# EAGLE design LEDRing (EAGLE 7.3.0)
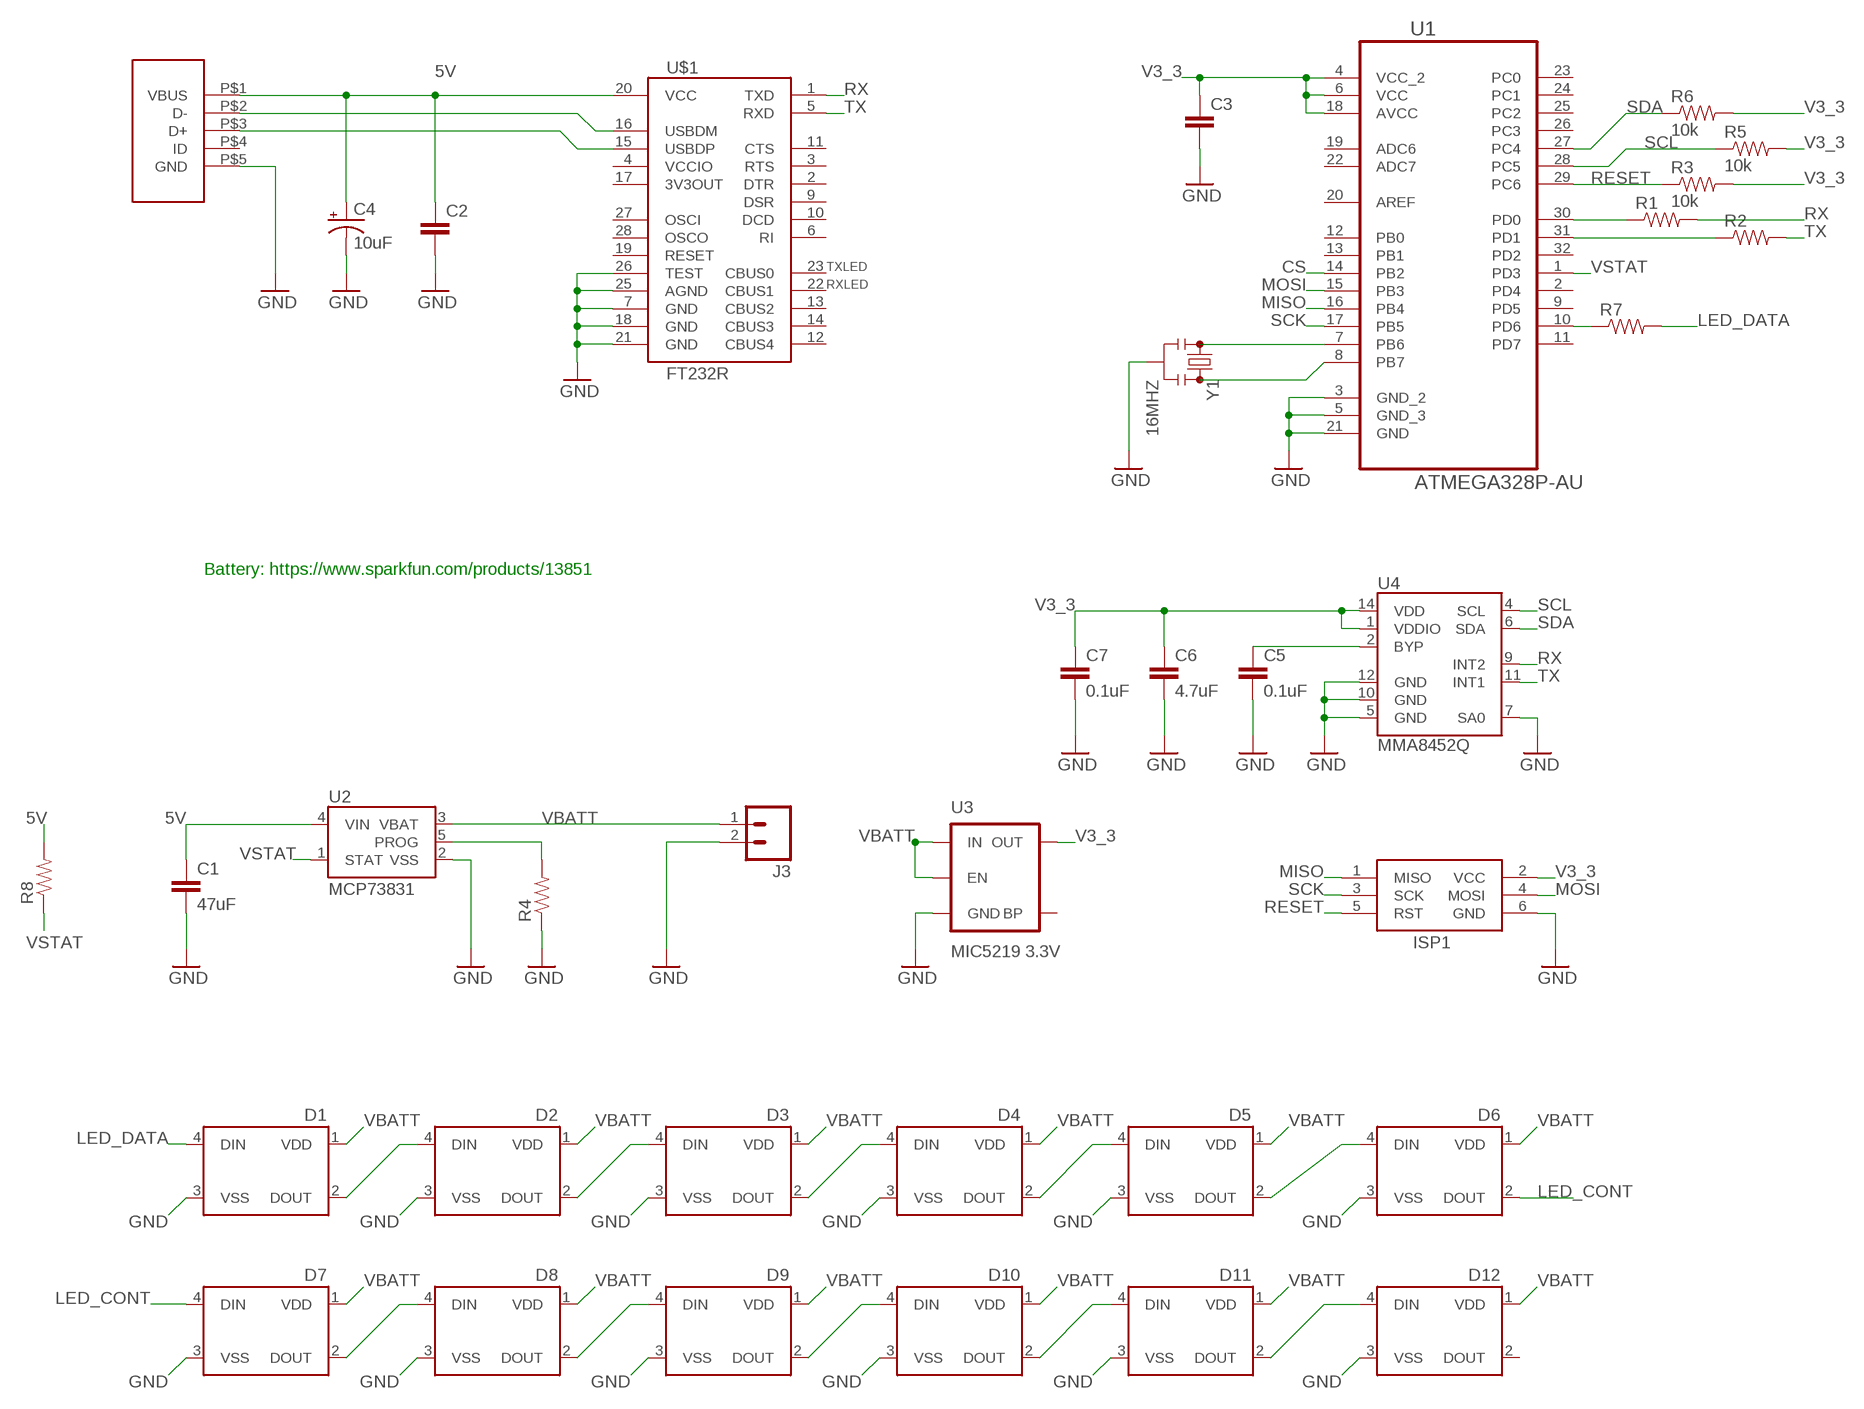
[diagram p0: schematic, sheet 1]

## Parts
C1  47uF  CAP0603-CAP  [0603-CAP]
C2  CAP0603-CAP  [0603-CAP]
C3  CAP0603-CAP  [0603-CAP]
C4  10uF  10UF-6.3V-20%(0603)(TANT)"  [0603-POL]
C5  0.1uF  CAP0603-CAP  [0603-CAP]
C6  4.7uF  CAP0603-CAP  [0603-CAP]
C7  0.1uF  CAP0603-CAP  [0603-CAP]
D1  WS2812B  [WS2812B]
D2  WS2812B  [WS2812B]
D3  WS2812B  [WS2812B]
D4  WS2812B  [WS2812B]
D5  WS2812B  [WS2812B]
D6  WS2812B  [WS2812B]
D7  WS2812B  [WS2812B]
D8  WS2812B  [WS2812B]
D9  WS2812B  [WS2812B]
D10  WS2812B  [WS2812B]
D11  WS2812B  [WS2812B]
D12  WS2812B  [WS2812B]
ISP1  AVRISP-BOX  [AVRISP-BOX]
J3  M02PTH  [1X02]
R1  RESISTOR0603-RES  [0603-RES]
R2  RESISTOR0603-RES  [0603-RES]
R3  10k  RESISTOR0603-RES  [0603-RES]
R4  RESISTOR0603-RES  [0603-RES]
R5  10k  RESISTOR0603-RES  [0603-RES]
R6  10k  RESISTOR0603-RES  [0603-RES]
R7  RESISTOR0603-RES  [0603-RES]
R8  RESISTOR0603-RES  [0603-RES]
U1  ATMEGA328P-AU  [QFP80P900X900X120-32N]
U2  MCP73831  [SOT23-5]
U3  MIC5219 3.3V  V_REG_MIC52193.3V  [SOT23-5]
U4  MMA8452Q  [QFN-16_0.5MM]
U$1  FT232R  [SSOP-28]
U$2  TE_USB_A121025CT  [TE_USB_A121025CT]
Y1  16MHZ  RESONATOR16MHZ  [RESONATOR-SMD]

## Nets
5V: C1.1 C2.1 C4.A(+) R8.2 U2.4(VIN) U$1.20(VCC) U$2.P$1(VBUS)
CS: U1.14(PB2)
GND: C1.2 C2.2 C3.2 C4.K(-) C5.2 C6.2 C7.2 D1.3(VSS) D2.3(VSS) D3.3(VSS) D4.3(VSS) D5.3(VSS) D6.3(VSS) D7.3(VSS) D8.3(VSS) D9.3(VSS) D10.3(VSS) D11.3(VSS) D12.3(VSS) ISP1.6(GND) J3.2 R4.1 U1.3(GND_2) U1.5(GND_3) U1.21(GND) U2.2(VSS) U3.2(GND) U4.5(GND) U4.7(SA0) U4.10(GND) U4.12(GND) U$1.7(GND) U$1.18(GND) U$1.21(GND) U$1.25(AGND) U$1.26(TEST) U$2.P$5(GND) Y1.2
LED_CONT: D6.2(DOUT) D7.4(DIN)
LED_DATA: D1.4(DIN) R7.2
MISO: ISP1.1(MISO) U1.16(PB4)
MOSI: ISP1.4(MOSI) U1.15(PB3)
N$1: R1.1 U1.30(PD0)
N$2: R2.1 U1.31(PD1)
N$3: C5.1 U4.2(BYP)
N$4: U$1.16(USBDM) U$2.P$2(D-)
N$5: U$1.15(USBDP) U$2.P$3(D+)
N$7: U1.8(PB7) Y1.3
N$8: U1.7(PB6) Y1.1
N$9: R4.2 U2.5(PROG)
N$10: R7.1 U1.10(PD6)
N$15: D1.2(DOUT) D2.4(DIN)
N$16: D2.2(DOUT) D3.4(DIN)
N$17: D3.2(DOUT) D4.4(DIN)
N$18: D4.2(DOUT) D5.4(DIN)
N$19: D5.2(DOUT) D6.4(DIN)
N$20: D7.2(DOUT) D8.4(DIN)
N$21: D8.2(DOUT) D9.4(DIN)
N$22: D9.2(DOUT) D10.4(DIN)
N$23: D10.2(DOUT) D11.4(DIN)
N$24: D11.2(DOUT) D12.4(DIN)
RESET: ISP1.5(RST) R3.1 U1.29(PC6)
RX: R1.2 U4.9(INT2) U$1.1(TXD)
SCK: ISP1.3(SCK) U1.17(PB5)
SCL: R5.1 U1.28(PC5) U4.4(SCL)
SDA: R6.1 U1.27(PC4) U4.6(SDA)
TX: R2.2 U4.11(INT1) U$1.5(RXD)
V3_3: C3.1 C6.1 C7.1 ISP1.2(VCC) R3.2 R5.2 R6.2 U1.4(VCC_2) U1.6(VCC) U1.18(AVCC) U3.5(OUT) U4.1(VDDIO) U4.14(VDD)
VBATT: D1.1(VDD) D2.1(VDD) D3.1(VDD) D4.1(VDD) D5.1(VDD) D6.1(VDD) D7.1(VDD) D8.1(VDD) D9.1(VDD) D10.1(VDD) D11.1(VDD) D12.1(VDD) J3.1 U2.3(VBAT) U3.1(IN) U3.3(EN)
VSTAT: R8.1 U1.1(PD3) U2.1(STAT)
Unconnected: D12.2(DOUT) U1.2(PD4) U1.9(PD5) U1.11(PD7) U1.12(PB0) U1.13(PB1) U1.19(ADC6) U1.20(AREF) U1.22(ADC7) U1.23(PC0) U1.24(PC1) U1.25(PC2) U1.26(PC3) U1.32(PD2) U3.4(BP) U$1.2(DTR) U$1.3(RTS) U$1.6(RI) U$1.9(DSR) U$1.10(DCD) U$1.11(CTS) U$1.12(CBUS4) U$1.13(CBUS2) U$1.14(CBUS3) U$1.17(3V3OUT) U$1.19(RESET) U$1.22(CBUS1) U$1.23(CBUS0) U$1.27(OSCI) U$1.28(OSCO) U$2.P$4(ID)

## Notes on the sheet
- Battery: https://www.sparkfun.com/products/13851

## Power pins joined to a net without a drawn wire
VCCIO: U$1.4(VCCIO)

## Library data of the parts
C1-C3 C5-C7 = SparkFun-Capacitors:CAP: Capacitor Standard 0603 ceramic capacitor, and 0.1" leaded capacitor.
C4 = SparkFun-Capacitors:10UF-6.3V-20%(0603)(TANT); PROD_ID: CAP-13210
D1-D12 = SparkFun-LED:WS2812B: WS2812B - Intelligent control LED integrated light source Technical Specifications: Power Supply Voltage (VDD): 3.5 to 5.3 V Input Voltage (VI): -0.5 to VDD+0.5 V Operating Junction Temperature (Topt): -25°C to +80°C Storage Temperature Range (Tstg): -55°C to +150°C; PROD_ID: DIO-12503
ISP1 = adafruit:AVRISP: AVR ISP HEADER Standard 6 pin header for AVR programming
J3 = SparkFun-Connectors:M02: Standard 2-pin 0.1" header. Use with - straight break away headers ( PRT-00116) - right angle break away headers (PRT-00553) - swiss pins (PRT-00743) - machine pins (PRT-00117) - female headers (PRT-00115) Molex polarized connector foot print use with: PRT-08233 with associated crimp pins and housings. 2.54_SCREWTERM for use with PRT-10571. 3.5mm Screw Terminal footprints for PRT-08084 5mm Screw Terminal footprints for use with PRT-08432
R1-R8 = SparkFun-Passives:RESISTOR: Resistor Basic schematic elements and footprints for 0603, 1206, and PTH resistors.
U1 = Atmel_By_element14_Batch_1-00:ATMEGA328P-AU: 8-bit Microcontroller with In-System Programmable Flash; MPN: ATMEGA328P-AU; OC_FARNELL: 1715486; OC_NEWARK: 14R4631; PACKAGE: TQFP-32; SUPPLIER: Atmel
U2 = SparkFun-PowerIC:MCP73831: Miniature single cell, fully integrated Li-Ion, Li-polymer charge management controller http://ww1.microchip.com/downloads/en/DeviceDoc/20001984g.pdf IC-09995; PROD_ID: IC-09995
U3 = SparkFun-PowerIC:V_REG_MIC5219: V_REG MIC5219 Standard 3.3V and 5V 500mA LDO voltage regulator in SOT-23 layout. Micrel part MIC5219. BP (by-pass) pin is used to lower output noise with 470pF cap, may be left open.; PROD_ID: VREG-09872
U4 = SparkFun-Sensors:MMA8452Q: MMA8452Q 3-Axis, 12/8-bit Digital Accelerometer Supply Voltage: 1.6-3.6V Range: +/- 2g, 4g, 8g Interface: I2C, 12-bit and 8-bit ODR: 1.56 Hz - 800 Hz Package: QFN-16 http://cache.freescale.com/files/sensors/doc/data_sheet/MMA8452Q.pdf; PROD_ID: IC-10769
U$1 = GeekAmmo:FT232R: FT232R USB UART IC The FT232R is a USB to serial UART interface with advanced features. http://www.ftdichip.com/Support/Documents/DataSheets/ICs/DS_FT232R.pdf
U$2 = LEDRingLib:TE_USB_A121025CT: TE USB Micro USB IP68 Digikey <http://www.digikey.com/en/ptm/t/te-connectivity/te-connectivity-amp/ip68-micro-usb?pn_sku=A121025CT-ND&part_id=5215144&video_source=Part_Detail>
Y1 = SparkFun-FreqCtrl:RESONATOR: Resonator Small SMD resonator. Used, eg, on the Arduino Pro/ Pro Mini boards. 8MHz- XTAL-08895 16MHz- XTAL-08900; PROD_ID: XTAL-08900

## Board
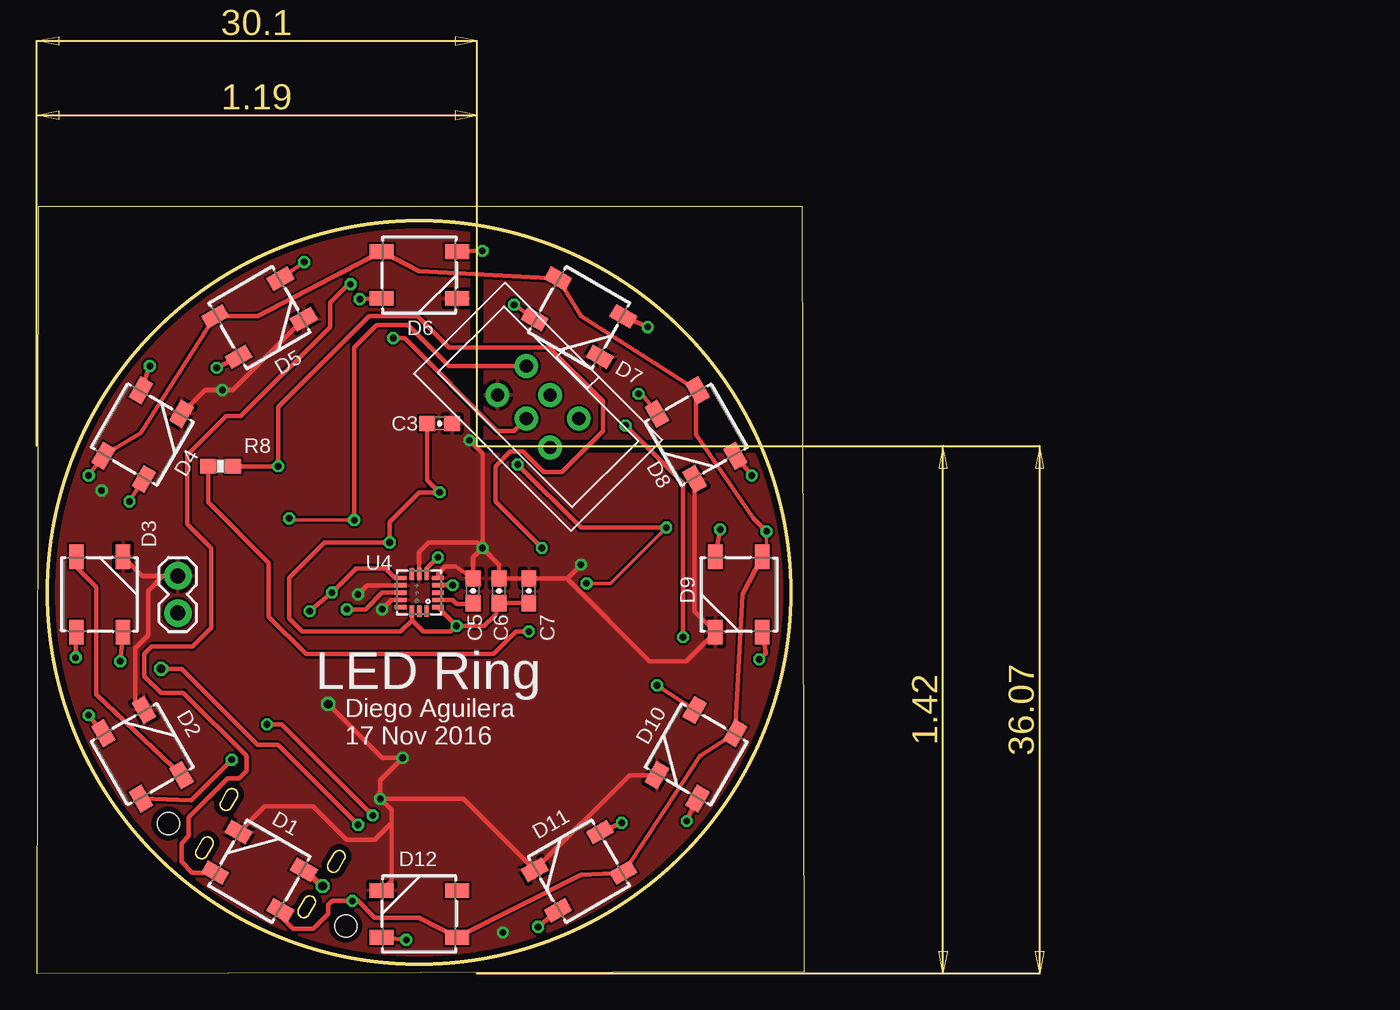
[diagram p1: board, top side]
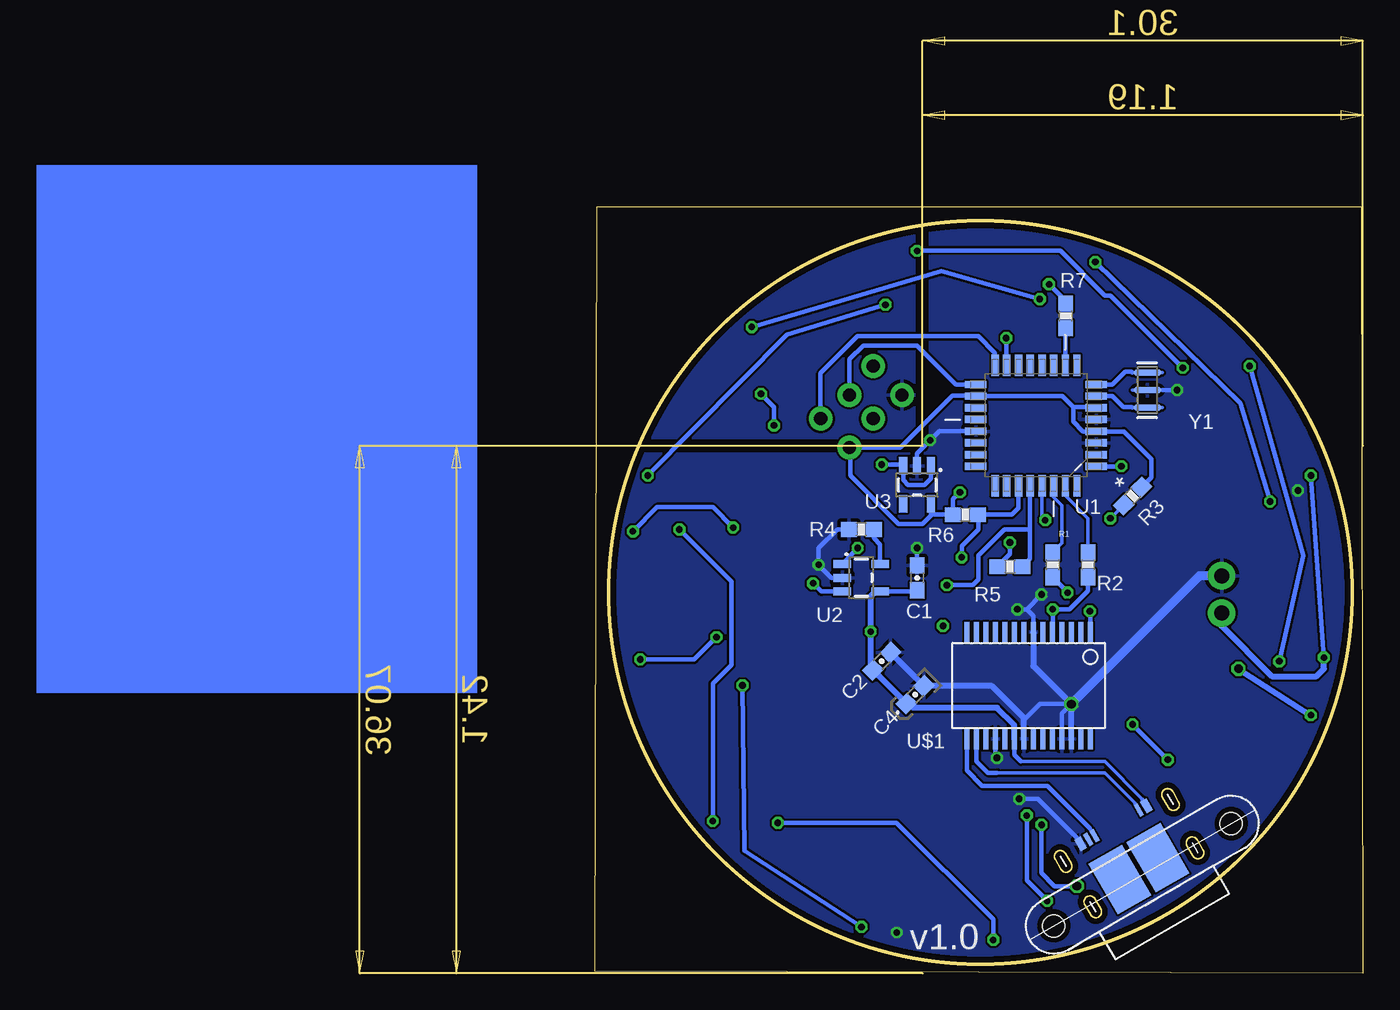
[diagram p2: board, bottom side, seen from below]

Size 52.5 x 52.44 mm. Coordinates in mm from the lower left corner, seen from the top.
Outline: 0,0 52.5,0.13 52.38,52.44 0.13,52.44 0,0
Outline: circle at 26.16,26.04 radius 25.4
Copper layers (1*16): Top 0.0356mm / dielectric 1.5011mm / Bottom 0.0356mm
Design rules "oshpark-2layer": minimum track width 6mil, minimum drill 13mil, track to track 6mil, track to pad 6mil, pad to pad 6mil, via to via 6mil, smd to smd 6mil, copper to edge 15mil, drill to drill 6mil, minimum pad ring 7mil, minimum via ring 7mil, stop-mask expansion 2.5mil, vias tented up to drill 0mil, thermal gap 10mil

### Footprints (pad centres in the part's own frame; a part is rotated, then mirrored left to right if it is on the bottom)
0603-CAP = smd 1.1 x 1: 1 -0.85,0; 2 0.85,0
0603-POL = smd 1.1 x 1: A 0.85,0; K -0.85,0
WS2812B = smd 1.651 x 1: 1 -2.577,1.6; 2 -2.577,-1.6; 3 2.577,-1.6; 4 2.577,1.6
AVRISP-BOX = drill 0.9 pad 1.626: 1 -1.397,2.54; 2 1.397,2.54; 3 -1.143,0; 4 1.143,0; 5 -1.397,-2.54; 6 1.397,-2.54
1X02 = drill 1.016 pad 1.88: 1 0,0; 2 2.54,0
0603-RES = smd 1.1 x 1: 1 -0.85,0; 2 0.85,0
QFP80P900X900X120-32N = smd 1.473 x 0.508: 1 -4.115,2.794; 2 -4.115,2.007; 3 -4.115,1.194; 4 -4.115,0.406; 5 -4.115,-0.406; 6 -4.115,-1.194; 7 -4.115,-2.007; 8 -4.115,-2.794; 17 4.115,-2.794; 18 4.115,-2.007; 19 4.115,-1.194; 20 4.115,-0.406; 21 4.115,0.406; 22 4.115,1.194; 23 4.115,2.007; 24 4.115,2.794 | smd 0.508 x 1.473: 9 -2.794,-4.115; 10 -2.007,-4.115; 11 -1.194,-4.115; 12 -0.406,-4.115; 13 0.406,-4.115; 14 1.194,-4.115; 15 2.007,-4.115; 16 2.794,-4.115; 25 2.794,4.115; 26 2.007,4.115; 27 1.194,4.115; 28 0.406,4.115; 29 -0.406,4.115; 30 -1.194,4.115; 31 -2.007,4.115; 32 -2.794,4.115
SOT23-5 = smd 0.55 x 1.2: 1 -0.95,-1.3; 2 0,-1.3; 3 0.95,-1.3; 4 0.95,1.3; 5 -0.95,1.3
QFN-16_0.5MM = smd 0.8 x 0.3: 1 -1.275,1; 2 -1.275,0.5; 3 -1.275,0; 4 -1.275,-0.5; 5 -1.275,-1; 9 1.275,-1; 10 1.275,-0.5; 11 1.275,0; 12 1.275,0.5; 13 1.275,1 | smd 0.3 x 0.8: 6 -0.5,-1.275; 7 0,-1.275; 8 0.5,-1.275; 14 0.5,1.275; 15 0,1.275; 16 -0.5,1.275
SSOP-28 = smd 0.348 x 1.397: 1 -4.225,-3.656; 2 -3.575,-3.656; 3 -2.925,-3.656; 4 -2.275,-3.656; 5 -1.625,-3.656; 6 -0.975,-3.656; 7 -0.325,-3.656; 8 0.325,-3.656; 9 0.975,-3.656; 10 1.625,-3.656; 11 2.275,-3.656; 12 2.925,-3.656; 13 3.575,-3.656; 14 4.225,-3.656; 15 4.225,3.656; 16 3.575,3.656; 17 2.925,3.656; 18 2.275,3.656; 19 1.625,3.656; 20 0.975,3.656; 21 0.325,3.656; 22 -0.325,3.656; 23 -0.975,3.656; 24 -1.625,3.656; 25 -2.275,3.656; 26 -2.925,3.656; 27 -3.575,3.656; 28 -4.225,3.656
TE_USB_A121025CT = smd 0.5 x 0.9: P$1 -2.6,-5.75; P$5 2.6,-5.75 | smd 0.3 x 0.9: P$2 -2,-5.75; P$3 1.5,-5.75; P$4 2,-5.75 | smd 2.65 x 3.98: P$6 -1.5,-2.29; P$7 1.5,-2.29 | hole 1.5: -7,-1.8; 7,-1.8
RESONATOR-SMD = smd 0.45 x 1.905: 1 -1.2,0; 2 0,0; 3 1.2,0

### Placement (x,y rotation side)
C1  30.48,27.05 90 bottom
C2  32.89,21.34 45 bottom
C3  27.56,37.59 0 top
C4  30.61,19.05 225 bottom
C5  29.84,26.16 90 top
C6  31.62,26.16 90 top
C7  33.66,26.16 90 top
D1  15.24,6.99 150 top
D2  7.24,14.99 120 top
D3  4.32,25.91 90 top
D4  7.24,36.83 60 top
D5  15.24,44.83 30 top
D6  26.16,47.75 0 top
D7  37.08,44.83 330 top
D8  45.09,36.83 300 top
D9  48.01,25.91 270 top
D10  45.09,14.99 240 top
D11  37.08,6.99 210 top
D12  26.16,4.06 180 top
ISP1  34.29,38.73 225 top
J3  9.65,24.64 90 top
R1  21.21,27.94 270 bottom
R2  18.8,27.94 270 bottom
R3  15.75,32.64 45 bottom
R4  34.29,30.35 0 bottom
R5  24.13,27.81 180 bottom
R6  27.18,31.37 180 bottom
R7  20.32,44.96 90 bottom
R8  12.57,34.67 180 top
U1  22.35,37.47 180 bottom
U2  34.29,27.05 270 bottom
U3  30.48,33.4 180 bottom
U4  26.16,26.04 180 top
U$1  22.86,19.68 180 bottom
U$2  14.17,5.18 210 bottom
Y1  14.73,39.88 90 bottom

### Tracks (layer width: path | path; a pad name or v marks a point on that pad's centre or on a via)
5V  (via drill 0.46 pad 0.25)
  Top 0.305: R8.2 11.72,32.22 15.88,28.07 15.88,24.38 18.41,21.84 31.24,21.84 32.77,23.37 v33.66,23.37
  Bottom 0.254: 23.37,14.48 17.65,14.48 15.11,11.94 U$2.P$1
  Bottom 0.305: U2.4 30.58,26.1 C1.1 | U$1.20 23.84,14.95 23.37,14.48
  Bottom 0.406: U$1.20 23.84,16.98 25.02,18.16 30.73,18.16 31.02,18.45 C4.A C2.1 33.66,20.9 v33.66,23.37 33.66,25.78 33.34,26.1 U2.4
GND  (via drill 0.46 pad 0.25, 0.6)
  Top 0.305: 29.44,27.04 C5.2 | U4.5 27.44,27.31 27.94,27.81 28.66,27.81 C5.2 | C5.2 29.84,28.45 v30.48,29.08 | v30.48,29.08 31.62,27.94 C6.2 C7.2 36.28,27.01 36.32,27.05 | v30.48,29.08 30.48,35.56 v29.59,36.45 | U4.7 26.16,28.83 26.8,29.46 30.1,29.46 v30.48,29.08 | U4.10 22.6,26.54 v21.97,25.91 | U4.12 24.27,25.54 v23.62,24.89 | v19.94,18.41 23.62,14.73 v25.02,14.73 23.5,13.21 v23.5,11.94 | D2.3 6.73,18.62 6.73,22.23 7.62,23.11 7.62,26.16 8.64,27.18 | 8.64,27.18 J3.2 | D3.3 7.22,27.18 8.64,27.18 | D1.3 15.58,11.43 18.92,11.43 21.21,9.14 23.11,9.14 24.26,10.29 | 24.26,10.29 24.26,11.18 v23.5,11.94 | D12.3 24.26,6.34 24.26,10.29 | v23.5,11.94 29.2,11.94 D11.3 40.52,13.55 D10.3 | D8.3 44.99,24.75 D9.3 44.41,21.34 41.91,21.34 36.32,26.92 36.32,27.05 | v37.21,27.94 36.32,27.05 | D4.3 11.53,39.88 v12.7,39.88 13.42,39.88 D5.3
  Bottom 0.254: 19.56,9.27 19.56,9.12 U$2.P$5
  Bottom 0.305: R4.1 35.94,30.35 37.21,29.08 v37.21,27.94 36.32,27.05 U2.2 | U3.2 30.48,35.56 v29.59,36.45 28.96,37.08 26.49,37.08 U1.21 | C1.2 v30.48,29.08 | v21.97,25.91 22.99,24.89 | 22.99,24.89 v23.62,24.89 | U$1.7 22.54,24.44 22.99,24.89 | U$1.18 25.14,14.85 v25.02,14.73 | U$1.21 23.18,17.33 22.1,18.41 v19.94,18.41 20.59,17.77 U$1.25 | 19.56,9.27 22.23,11.94 v23.5,11.94 | v12.7,39.88 13.72,39.88
  Bottom 0.406: U$1.26 v19.93,18.41 v19.94,18.41 22.54,21.01 U$1.7 | C2.2 C4.K 25.37,19.65 23.18,17.47 U$1.21
  Bottom 0.61: J3.2 11.18,27.18 v19.94,18.41
  other vias: 31.88,2.79 4.45,33.02
  pour Bottom: 0.13,0.13 53.09,0.13 53.09,53.09 0.13,53.09
  pour Top: 0.13,0.13 53.72,0.13 53.72,54.23 0.13,54.23
LED_CONT  (via drill 0.46 pad 0.25)
  Top 0.305: D7.4 v41.78,44.2 | D6.2 v22.1,46.1
  Bottom 0.305: v41.78,44.2 28.83,48.01 v22.1,46.1
LED_DATA  (via drill 0.46 pad 0.25)
  Top 0.305: v21.46,47.12 21.34,47.12 20.07,45.85 20.07,44.2 13.97,38.1 12.95,38.1 10.29,35.43 10.29,30.73 11.94,29.08 11.94,23.62 10.67,22.35 7.87,22.35 7.37,21.84 7.37,20.32 8.51,19.18 10.03,19.18 14.35,14.86 14.35,13.84 13.84,13.34 13.08,13.34 10.41,10.67 10.41,9.4 9.91,8.89 9.91,7.62 10.64,6.89 D1.4
  Bottom 0.305: R7.2 20.32,45.97 v21.46,47.12
MISO
  Bottom 0.305: ISP1.1 37.07,41.03 34.54,43.56 26.29,43.56 25.15,42.42 U1.16
MOSI  (via drill 0.46 pad 0.25)
  Top 0.305: ISP1.4 32.64,37.08 31.5,37.08 25.15,43.43 v24.38,43.43
  Bottom 0.305: U1.15 24.36,43.41 v24.38,43.43
N$1
  Bottom 0.254: U1.30 21.16,32.59 20.57,32 20.57,29.43 R1.1
  Bottom 0.305: R1.1 21.16,28.79
N$2
  Bottom 0.254: U1.31 20.34,32.66 18.8,31.11 R2.1
N$3
  Top 0.305: U4.2 28.44,25.54 28.7,25.27 29.43,25.27 C5.1
N$4
  Bottom 0.254: 25.02,13.72 17.65,13.72 15.62,11.68 U$2.P$2
  Bottom 0.305: U$1.16 26.43,14.5 25.65,13.72 25.02,13.72
N$5
  Bottom 0.254: 18.67,9.91 U$2.P$3
  Bottom 0.305: U$1.15 27.09,13.88 26.04,12.83 21.59,12.83 18.67,9.91
N$7
  Bottom 0.305: U1.8 17.14,40.26 16.26,41.15 15.82,41.15 15.75,41.08
N$8
  Bottom 0.305: U1.7 17.12,39.47 16.38,38.73 15.8,38.73 15.75,38.68
N$9
  Bottom 0.305: R4.2 33.44,29.76 33.02,29.34 33.02,28.03 U2.5
N$10
  Bottom 0.305: R7.1 20.34,44.08 U1.10
N$15  (via drill 0.46 pad 0.25, 0.6)
  Top 0.305: D2.4 v3.56,17.65 | v21.97,10.16 16.51,15.62 15.11,15.62 9.91,20.83 v8.51,20.83
  Top 0.406: D1.2 v19.56,5.97
  Bottom 0.305: v21.97,10.16 21.97,6.86 21.08,5.97 v19.56,5.97
  Bottom 0.406: v8.51,20.83 v3.56,17.65 3.68,17.65
N$16
  Top 0.305: D2.2 4.06,19.07 4.06,26.42 2.46,28.02 D3.4
N$17  (via drill 0.46 pad 0.25)
  Top 0.305: D4.4 v7.75,41.53 | D3.2 v5.71,21.34
  Bottom 0.305: v7.75,41.53 4.06,28.57 v5.71,21.34
N$18  (via drill 0.46 pad 0.25)
  Top 0.305: D5.4 v18.29,48.64 | D4.2 v6.35,32.26
  Bottom 0.305: v18.29,48.64 8.38,38.99 v6.35,32.26
N$19  (via drill 0.46 pad 0.25)
  Top 0.305: D6.4 v30.48,49.4 | D5.2 v12.32,41.4
  Bottom 0.305: v12.32,41.4 17.27,46.35 17.65,46.35 20.7,49.4 v30.48,49.4
N$20  (via drill 0.46 pad 0.25)
  Top 0.305: D8.4 v48.9,34.04 | D7.2 v32.64,45.72
  Bottom 0.305: v48.9,34.04 39.37,43.69 v32.64,45.72
N$21  (via drill 0.46 pad 0.25)
  Top 0.305: D9.4 49.86,21.92 v49.4,21.46 | v44.2,22.99 44.2,33.53 v40.26,37.47 | D8.2 41.38,39.62 v41.15,39.62
  Bottom 0.305: v49.4,21.46 45.72,21.46 v44.2,22.99 | v40.26,37.47 40.26,38.73 v41.15,39.62
N$22  (via drill 0.46 pad 0.25)
  Top 0.305: D9.2 v46.74,30.35 | D10.4 v44.45,10.41
  Bottom 0.305: v44.45,10.41 44.45,19.81 43.18,21.08 43.18,26.8 v46.74,30.35
N$23  (via drill 0.46 pad 0.25)
  Top 0.305: D11.4 v34.29,3.17 | D10.2 v42.42,19.68
  Bottom 0.305: v34.29,3.17 42.29,8.38 v42.42,19.68
N$24  (via drill 0.46 pad 0.25)
  Top 0.305: D11.2 v40.01,10.29 | D12.4 v25.27,2.29
  Bottom 0.305: v40.01,10.29 31.88,10.29 25.27,3.68 v25.27,2.29
RESET  (via drill 0.46 pad 0.25)
  Top 0.254: v21.72,30.99 17.4,30.99 v17.27,31.11
  Top 0.305: ISP1.5 28.33,41.52 28.2,41.52 25.4,44.32 23.24,44.32 21.72,42.8 v21.72,30.99
  Bottom 0.254: U1.29 21.95,31.22 v21.72,30.99 | R3.1 v17.27,31.11
RX  (via drill 0.46 pad 0.25)
  Top 0.305: 18.64,24.48 v18.67,24.77 v20.19,26.04 21.8,27.65 21.8,27.69 23.88,27.69 24.53,27.04 U4.9
  Bottom 0.305: 21.21,27.05 R1.2 v20.19,26.04 | U$1.1 18.64,24.48 v18.67,24.77
SCK
  Bottom 0.305: ISP1.3 35.1,41.99 34.16,42.93 30.48,42.93 27.81,40.26 U1.17
SCL  (via drill 0.46 pad 0.25)
  Top 0.305: v28.45,26.54 U4.4
  Bottom 0.305: U1.28 22.76,30.23 | 22.76,30.23 22.76,28.34 R5.1 | 22.76,30.23 22.89,30.35 24.51,30.35 26.29,28.57 26.29,26.92 26.67,26.54 28.06,26.54 | 28.06,26.54 28.07,26.54 | 28.06,26.54 v28.45,26.54
SDA  (via drill 0.46 pad 0.25)
  Top 0.305: U4.6 26.66,27.68 v27.43,28.45
  Bottom 0.305: U1.27 23.55,31.83 24,31.37 R6.1 26.29,31.33 26.29,30.35 27.43,29.21 v27.43,28.45
TX  (via drill 0.46 pad 0.25)
  Top 0.305: U4.11 23.62,26.04 22.48,24.89 v21.21,24.89
  Bottom 0.305: R2.2 18.8,26.16 20.07,24.89 v21.21,24.89 21.21,23.37 U$1.5
V3_3  (via drill 0.46 pad 0.25)
  Top 0.305: C7.1 C6.1 31.37,24.51 30.61,23.75 v28.7,23.75 | U4.1 27.44,25.01 v28.7,23.75 | v28.7,23.75 28.32,23.37 26.42,23.37 25.66,24.12 U4.14 25.66,24.14 24.89,23.37 18.16,23.37 17.27,24.26 17.27,27.05 19.68,29.46 v24.13,29.46 24.13,30.86 26.16,32.89 v27.56,32.89 | 27.47,32.98 v27.56,32.89 | C3.1 26.71,33.74 v27.56,32.89
  Bottom 0.305: R3.2 14.48,33.91 14.48,35.18 16.36,37.06 U1.4 19.15,37.06 19.81,37.72 19.81,38.73 | 34.42,35.95 ISP1.2 35.05,35.91 35.05,34.04 31.75,30.73 30.1,30.73 29.53,31.3 | 34.42,35.95 31.61,35.95 28.07,39.5 26.49,39.5 U1.18 20.55,39.47 19.81,38.73 | 19.81,38.73 18.31,38.73 U1.6 | U3.5 29.53,31.3 | 34.42,35.95 34.42,35.81 | 29.53,31.3 29.46,31.37 R6.2 28.03,32.42 v27.56,32.89 | v24.13,29.46 24.13,28.66 R5.2
VBATT  (via drill 0.46 pad 0.25)
  Top 0.254: v37.59,26.67 39.24,26.67 v43.05,30.48 | D9.1 49.91,28.54 v49.91,30.23
  Top 0.305: D9.1 48.26,25.91 D10.1 45.34,14.86 D11.1 37.21,6.73 D12.1 26.16,3.81 23.11,3.81 21.97,4.95 v21.59,4.95 20.19,4.95 19.94,4.7 19.94,4.06 18.92,3.05 17.53,3.05 16.67,3.9 D1.1 | D3.1 v2.67,21.59 | v3.56,34.04 D4.1 7.11,36.96 D5.1 15.11,44.96 D6.1 26.16,48.01 D7.1 37.21,44.96 D8.1 45.09,39.77 45.09,36.83 49.02,31.11 v49.91,30.23 | D2.1 10.56,11.83 v13.34,14.61 | v15.75,17.02 16.76,17.02 v22.99,10.79 | v32.89,34.8 37.21,30.48 v43.05,30.48
  Bottom 0.305: U3.1 29.53,33.84 29.97,33.4 31.11,33.4 31.43,33.72 U3.3 31.53,34.8 v32.89,34.8 | U2.3 37.02,26.1 v37.59,26.67 | v2.67,21.59 v3.56,34.04 | v43.05,30.48 44.45,31.88 48.26,31.88 v49.91,30.23 | v13.34,14.61 v15.75,17.02 | v22.99,10.79 22.99,6.35 v21.59,4.95
  Bottom 0.406: J3.1 9.65,23.75 6.22,20.32 3.17,20.32 2.67,20.83 v2.67,21.59
VSTAT  (via drill 0.46 pad 0.25)
  Top 0.305: R8.1 v16.51,34.67 16.51,38.73 22.73,44.96 26.04,44.96 28.19,42.8 35.05,42.8 38.73,39.12 38.73,37.08 35.94,34.29 34.67,34.29 33.27,35.69 32.38,35.69 31.37,34.67 31.37,32.26 v34.54,29.08
  Bottom 0.305: U1.1 v16.51,34.67 | U2.1 34.54,29.05 v34.54,29.08
(copper drawn outside any net)
  shapes: Bottom area x1

### Text on the board
tPlace: LED Ring | Diego Aguilera / 17 Nov 2016
bNames: v1.0